# Altium schematic sheet TopLevel.SchDoc: LTC2949 Top Level
size A4; Author: Leo Xie & Naveela Sookoo; Organization: Waterloop; Address1: 200 University Avenue W; Address2: Engineering 5, 1104; Address3: Waterloo, Ontario; Address4: N2L 3G1; DocumentNumber: 1; Revision: 1; SheetNumber: 1; SheetTotal: 3
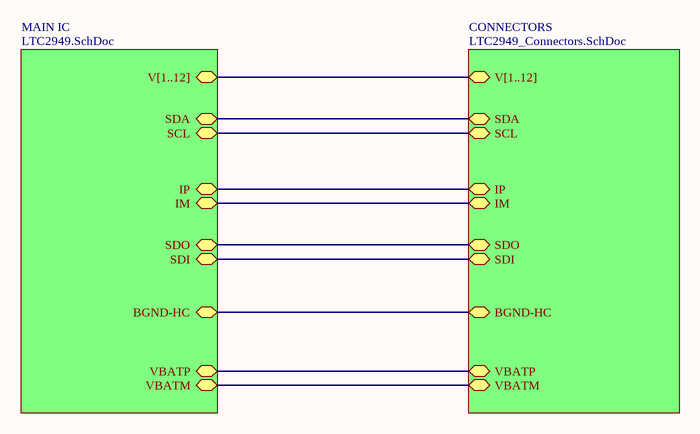
[diagram p0: TopLevel.SchDoc]

## Sub-sheets
CONNECTORS = LTC2949_Connectors.SchDoc: V[1..12] (bidir), SDA (bidir), SCL (bidir), VBATP (bidir), VBATM (bidir), BGND-HC (bidir), IP (bidir), IM (bidir), SDO (bidir), SDI (bidir)
MAIN IC = LTC2949.SchDoc: V[1..12] (bidir), SDA (bidir), SCL (bidir), VBATP (bidir), VBATM (bidir), BGND-HC (bidir), IP (bidir), IM (bidir), SDO (bidir), SDI (bidir)

## Nets
(unnamed): sheet MAIN IC/SDA, sheet CONNECTORS/SDA
(unnamed): sheet MAIN IC/SCL, sheet CONNECTORS/SCL
(unnamed): sheet MAIN IC/VBATP, sheet CONNECTORS/VBATP
(unnamed): sheet MAIN IC/VBATM, sheet CONNECTORS/VBATM
(unnamed): sheet MAIN IC/BGND-HC, sheet CONNECTORS/BGND-HC
(unnamed): sheet MAIN IC/IP, sheet CONNECTORS/IP
(unnamed): sheet MAIN IC/IM, sheet CONNECTORS/IM
(unnamed): sheet MAIN IC/SDO, sheet CONNECTORS/SDO
(unnamed): sheet MAIN IC/SDI, sheet CONNECTORS/SDI

## Buses and harness runs
bus sheet CONNECTORS/V[1..12] = sheet MAIN IC/V[1..12]

## Notes on the sheet
- Title:
- Size:
- Date:
- A4
- Author:
- Revision:
- Sheet
- of
- File: